# Altium schematic sheet 12Vin_5Vo_1A8_switchreg.SchDoc
size A
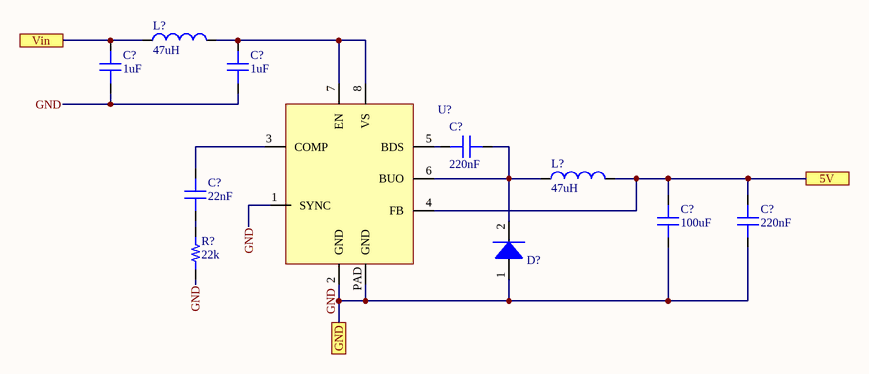
[diagram p0: 12Vin_5Vo_1A8_switchreg.SchDoc]

## Parts
(Parts that share a designator on the sheet are numbered #1, #2 ... from top to bottom, then left to right.)
C?#1  capacitance: 1uF  [0603]  (hidden comment: capacitor)
C?#2  capacitance: 1uF  [0603]  (hidden comment: capacitor)
C?#3  capacitance: 220nF  [0603]  (hidden comment: capacitor)
C?#4  capacitance: 22nF  [0603]  (hidden comment: capacitor)
C?#5  capacitance: 100uF  [1206]  (hidden comment: capacitor)
C?#6  capacitance: 220nF  [0603]  (hidden comment: capacitor)
D?  *  [SOD-128]  (value not drawn)
L?#1  47uH  [744771147]
L?#2  47uH  [744771147]
R?  resistance: 22k  [0603]  (hidden comment: resistor)
U?  IFX91041EJV50XUMA1  [PG-DSO-8-27]  (value not drawn)

## Ports
5V, GND, Vin

## Nets
5V: C?#5.1 C?#6.1 L?#2.2 U?.4(FB) ; port 5V
GND: C?#1.1 C?#2.1 C?#5.2 C?#6.2 D?.1(A) R?.1 U?.1(SYNC) U?.2(GND) U?.PAD(GND) ; port GND
Vin: C?#1.2 L?#1.1 ; port Vin
NetC?#2_2: C?#2.2 L?#1.2 U?.7(EN) U?.8(VS)
NetC?#3_1: C?#3.1 U?.5(BDS)
NetC?#3_2: C?#3.2 D?.2(K) L?#2.1 U?.6(BUO)
NetC?#4_1: C?#4.1 U?.3(COMP)
NetC?#4_2: C?#4.2 R?.2

## Library data of the parts
C?#1-C?#4 C?#6 = 1: Generic 0603 capacitor; id: 1; voltage: 50; dielectric: Ceramic; percent tolerance: 10; Name: 0603 Capacitor; ESR: 1; package: 0603; quantity: 0
C?#5 = 2: Generic 1206 capacitor; id: 2; voltage: 50; dielectric: Ceramic; percent tolerance: 20; ESR: 1; Name: 1206 Capacitor; package: 1206; quantity: 0
D? = 12: DIODE SCHOTTKY 30V 5A TMINIP2; id: 12; Name: DB2431200L; mfrpartno: *; package: SOD-128; quantity: 0; link: https://www.digikey.com/product-detail/en/panasonic-electronic-components/DB2431200L/DB2431200LCT-ND/3884430
L?#1 L?#2 = 1: 47µH Shielded Wirewound Inductor 2.21A 75mOhm; id: 1; Imax (A): 2.21000003814697; tolerance (%): 0; Name: 744771147; package: Nonstandar; inductance: 47uH; resistance: 75mOhm; quantity: 0; link: https://www.digikey.com/product-detail/en/wurth-electronics-inc/744771147/732-1214-2-ND/1638619
R? = 1: id: 1; Name: 0603 Resistor; percent tolerance: 5; package: 0603; quantity: 0
U? = 8: Buck Switching Regulator IC Positive Fixed 5V; id: 8; Imax (A): 1.79999995231628; Name: IFX91041EJV50XUMA1; package: 8-SOIC; quantity: 0; link: https://www.digikey.com/product-detail/en/infineon-technologies/IFX91041EJV50XUMA1/IFX91041EJV50XUMA1CT-ND/3300395